# Altium project PCB_Project.PrjPcb
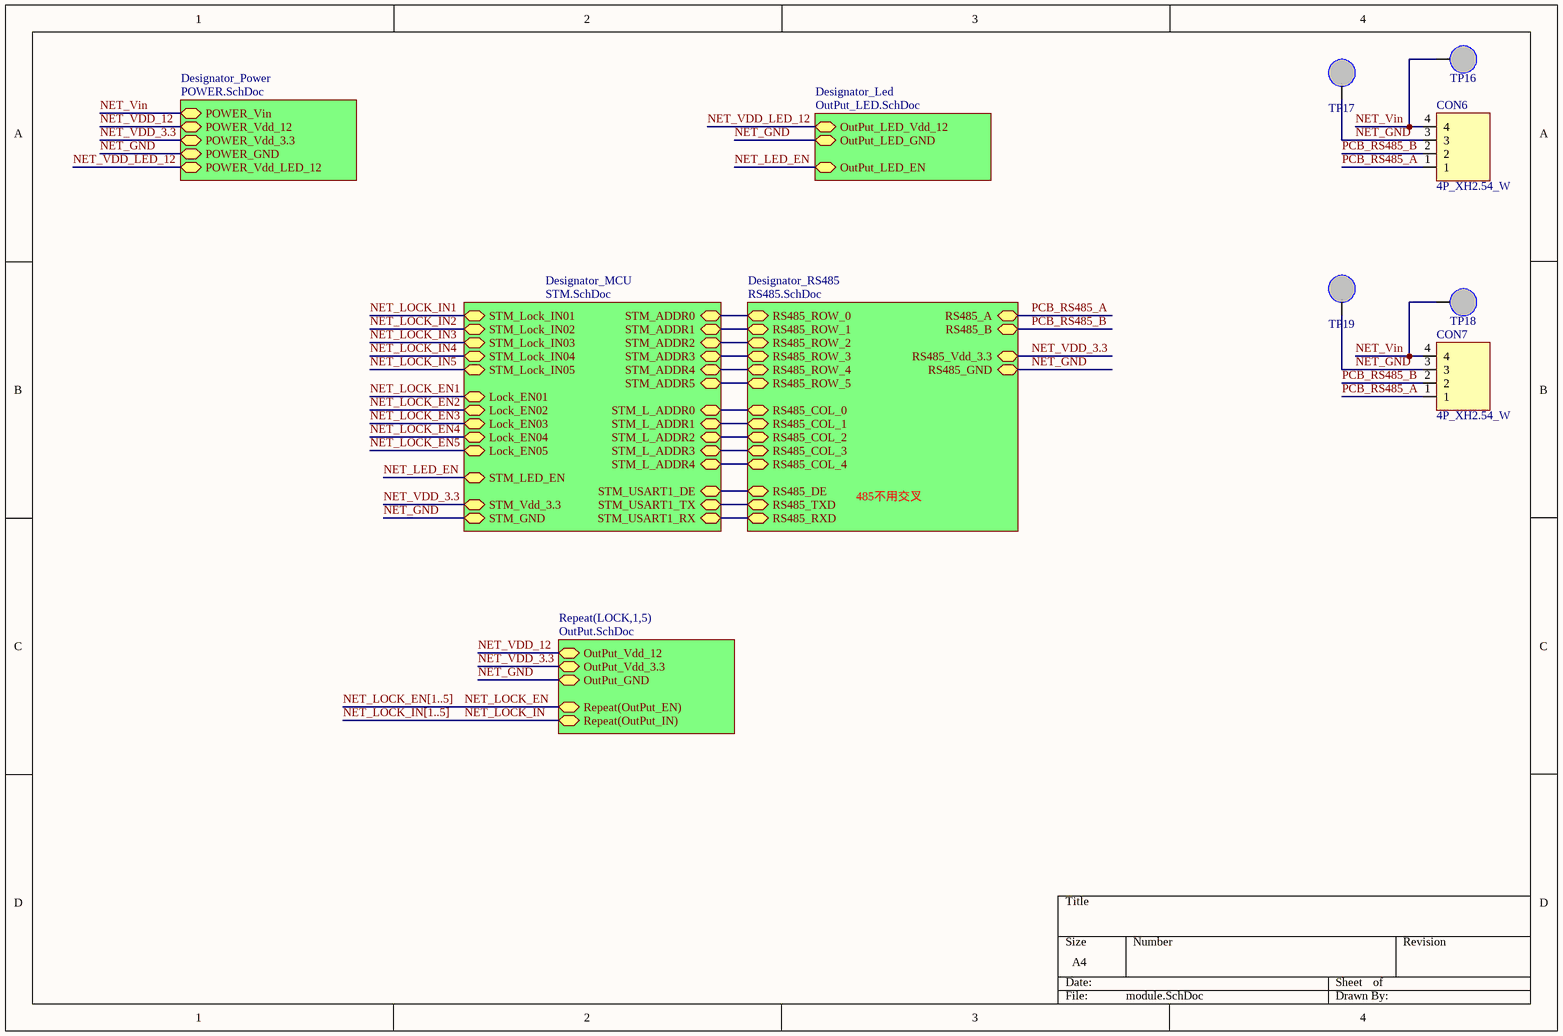
[diagram p0: module.SchDoc]
6 sheets, 158 parts. Net scope: strictly hierarchical (ports join the sheet entries above them; power ports are local).
Board file: Lock_5chanel.PcbDoc
Sheets:
  module.SchDoc
    Designator_MCU = STM.SchDoc
    Designator_Power = POWER.SchDoc
    LOCK1 = OutPut.SchDoc
    LOCK2 = OutPut.SchDoc
    LOCK3 = OutPut.SchDoc
    LOCK4 = OutPut.SchDoc
    LOCK5 = OutPut.SchDoc
    Designator_Led = OutPut_LED.SchDoc
    Designator_RS485 = RS485.SchDoc

## Sheet module.SchDoc
size A4

### Parts
CON6  4P_XH2.54_W  [XH2.54-WS-4P]
CON7  4P_XH2.54_W  [XH2.54-WS-4P]
TP16  TP  [TP]  (value not drawn)
TP17  TP  [TP]  (value not drawn)
TP18  TP  [TP]  (value not drawn)
TP19  TP  [TP]  (value not drawn)

### Sub-sheets
Designator_Led = OutPut_LED.SchDoc: OutPut_LED_Vdd_12, OutPut_LED_EN, OutPut_LED_GND
Designator_MCU = STM.SchDoc: STM_ADDR1, STM_ADDR5, STM_ADDR3, STM_ADDR2, STM_ADDR0, STM_ADDR4, STM_L_ADDR3, STM_L_ADDR1, STM_L_ADDR0, STM_L_ADDR2, STM_L_ADDR4, STM_USART1_RX, STM_USART1_TX, STM_USART1_DE, STM_Lock_IN05, STM_Lock_IN04, STM_Lock_IN01, STM_Lock_IN03, STM_Lock_IN02, Lock_EN05, Lock_EN04, Lock_EN03, Lock_EN02, Lock_EN01, STM_GND, STM_LED_EN, STM_Vdd_3.3
Designator_Power = POWER.SchDoc: POWER_GND, POWER_Vdd_12, POWER_Vdd_3.3, POWER_Vin, POWER_Vdd_LED_12
Designator_RS485 = RS485.SchDoc: RS485_ROW_4, RS485_ROW_2, RS485_ROW_3, RS485_ROW_0, RS485_ROW_1, RS485_COL_0, RS485_DE, RS485_RXD, RS485_GND, RS485_Vdd_3.3, RS485_TXD, RS485_COL_4, RS485_COL_3, RS485_COL_2, RS485_COL_1, RS485_ROW_5, RS485_A, RS485_B  | : 485不用交叉
Repeat(LOCK,1,5) = OutPut.SchDoc: OutPut_Vdd_3.3, Repeat(OutPut_EN), OutPut_Vdd_12, Repeat(OutPut_IN), OutPut_GND

### Nets
NET_GND: CON6.3 CON7.3 TP17.1 TP19.1 ; sheet Designator_MCU/STM_GND, sheet Designator_Power/POWER_GND, sheet Repeat(LOCK,1,5)/OutPut_GND, sheet Designator_Led/OutPut_LED_GND, sheet Designator_RS485/RS485_GND
NET_VDD_3.3: sheet Designator_MCU/STM_Vdd_3.3, sheet Designator_Power/POWER_Vdd_3.3, sheet Repeat(LOCK,1,5)/OutPut_Vdd_3.3, sheet Designator_RS485/RS485_Vdd_3.3
NET_VDD_12: sheet Designator_Power/POWER_Vdd_12, sheet Repeat(LOCK,1,5)/OutPut_Vdd_12
NET_VDD_LED_12: sheet Designator_Power/POWER_Vdd_LED_12, sheet Designator_Led/OutPut_LED_Vdd_12
ADDR0: sheet Designator_MCU/STM_ADDR0, sheet Designator_RS485/RS485_ROW_0
ADDR1: sheet Designator_MCU/STM_ADDR1, sheet Designator_RS485/RS485_ROW_1
ADDR2: sheet Designator_MCU/STM_ADDR2, sheet Designator_RS485/RS485_ROW_2
ADDR3: sheet Designator_MCU/STM_ADDR3, sheet Designator_RS485/RS485_ROW_3
ADDR4: sheet Designator_MCU/STM_ADDR4, sheet Designator_RS485/RS485_ROW_4
ADDR5: sheet Designator_MCU/STM_ADDR5, sheet Designator_RS485/RS485_ROW_5
COL_0: sheet Designator_MCU/STM_L_ADDR0, sheet Designator_RS485/RS485_COL_0
COL_1: sheet Designator_MCU/STM_L_ADDR1, sheet Designator_RS485/RS485_COL_1
COL_2: sheet Designator_MCU/STM_L_ADDR2, sheet Designator_RS485/RS485_COL_2
COL_3: sheet Designator_MCU/STM_L_ADDR3, sheet Designator_RS485/RS485_COL_3
COL_4: sheet Designator_MCU/STM_L_ADDR4, sheet Designator_RS485/RS485_COL_4
DE: sheet Designator_MCU/STM_USART1_DE, sheet Designator_RS485/RS485_DE
NET_LED_EN: sheet Designator_MCU/STM_LED_EN, sheet Designator_Led/OutPut_LED_EN  [project net EN]
NET_LOCK_EN: sheet Repeat(LOCK,1,5)/Repeat(OutPut_EN)
NET_LOCK_IN: sheet Repeat(LOCK,1,5)/Repeat(OutPut_IN)
NET_Vin: CON6.4 CON7.4 TP16.1 TP18.1 ; sheet Designator_Power/POWER_Vin
PCB_RS485_A: CON6.1 CON7.1 ; sheet Designator_RS485/RS485_A
PCB_RS485_B: CON6.2 CON7.2 ; sheet Designator_RS485/RS485_B
RXD: sheet Designator_MCU/STM_USART1_RX, sheet Designator_RS485/RS485_RXD
TXD: sheet Designator_MCU/STM_USART1_TX, sheet Designator_RS485/RS485_TXD

Not connected (* = marked no-connect by the designer): CON6 A B; CON7 A B

### Buses and harness runs
bus NET_LOCK_EN[1..5]
bus NET_LOCK_IN[1..5]

## Sheet STM.SchDoc
size A4
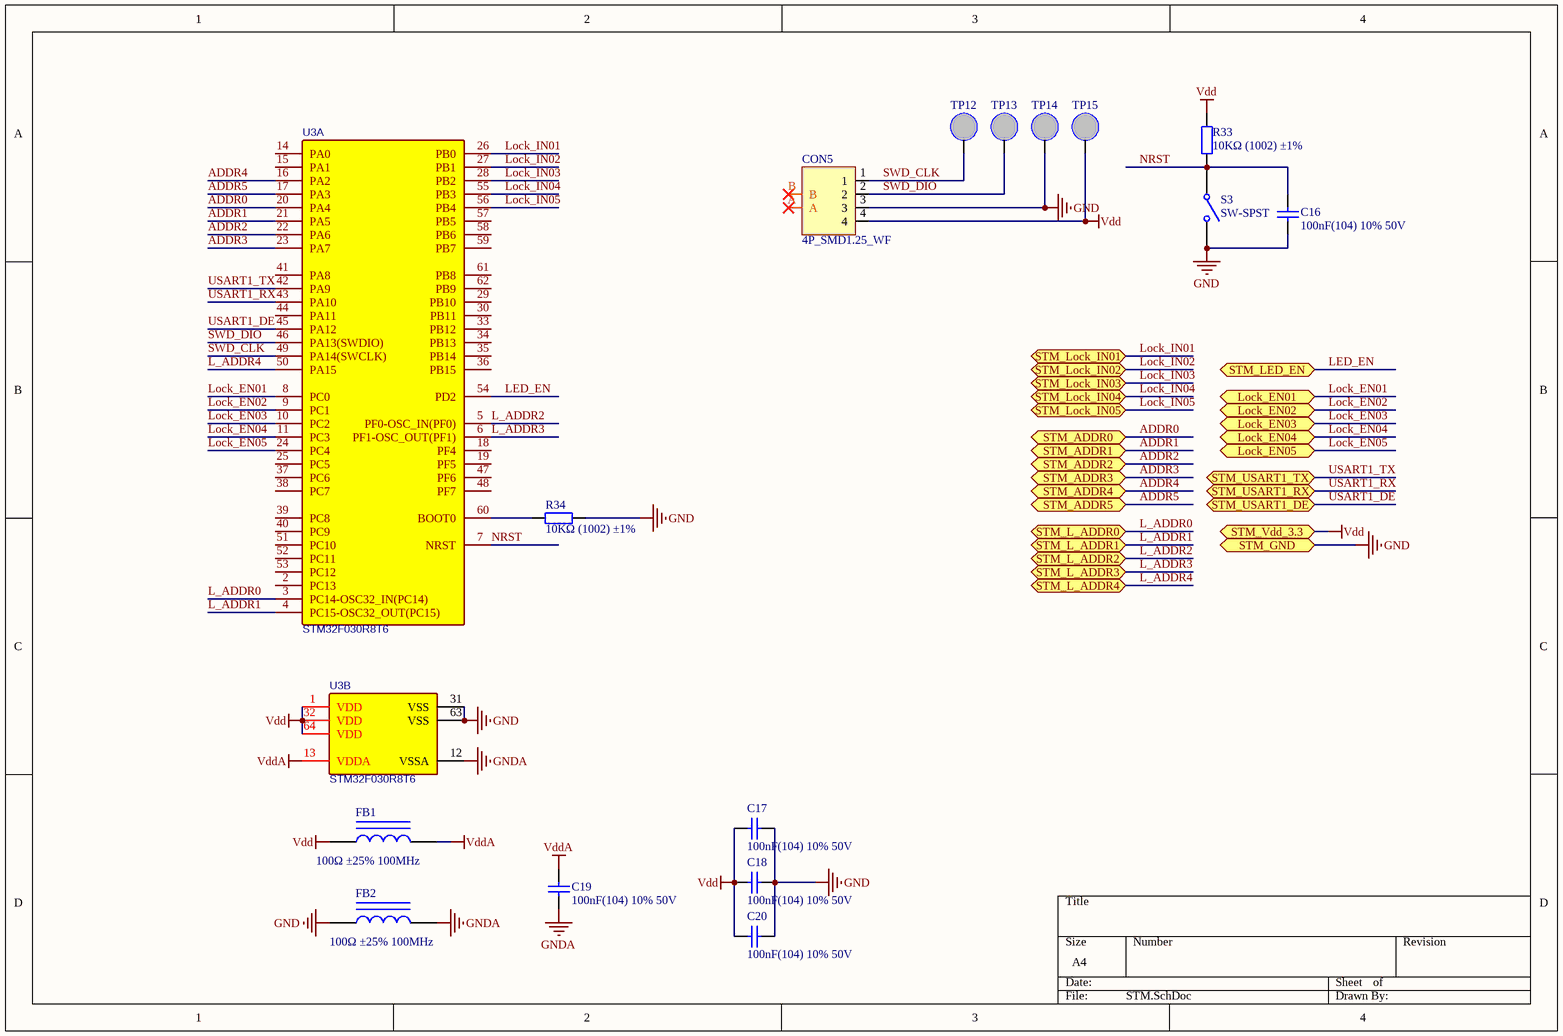
[diagram p1: STM.SchDoc]

### Parts
C16  100nF(104) 10% 50V  [0805_C]
C17  100nF(104) 10% 50V  [0805_C]
C18  100nF(104) 10% 50V  [0805_C]
C19  100nF(104) 10% 50V  [0805_C]
C20  100nF(104) 10% 50V  [0805_C]
CON5  4P_SMD1.25_WF  [MX 1.25-LS-4P]
FB1  100Ω ±25% 100MHz  [0805_L]
FB2  100Ω ±25% 100MHz  [0805_L]
R33  10KΩ (1002) ±1%  [0805_R]
R34  10KΩ (1002) ±1%  [0805_R]
S3  SW-SPST  [key]
TP12  TP  [TP]  (value not drawn)
TP13  TP  [TP]  (value not drawn)
TP14  TP  [TP]  (value not drawn)
TP15  TP  [TP]  (value not drawn)
U3  STM32F030R8T6  [LQFP-64_10X10X05P]  (parts A,B of 2)

### Ports
Lock_EN01, Lock_EN02, Lock_EN03, Lock_EN04, Lock_EN05, STM_ADDR0, STM_ADDR1, STM_ADDR2, STM_ADDR3, STM_ADDR4, STM_ADDR5, STM_GND, STM_L_ADDR0, STM_L_ADDR1, STM_L_ADDR2, STM_L_ADDR3, STM_L_ADDR4, STM_LED_EN, STM_Lock_IN01, STM_Lock_IN02, STM_Lock_IN03, STM_Lock_IN04, STM_Lock_IN05, STM_USART1_DE, STM_USART1_RX, STM_USART1_TX, STM_Vdd_3.3

### Nets
GND: C16.1 C17.1 C18.1 C20.1 CON5.3 FB2.1 R34.2 S3.2(NO) TP14.1 U3.31(VSS) U3.63(VSS) ; port STM_GND  [project net NET_GND]
GNDA: C19.1 FB2.2 U3.12(VSSA)
Vdd: C17.2 C18.2 C20.2 CON5.4 FB1.1 R33.2 TP15.1 U3.1(VDD) U3.32(VDD) U3.64(VDD) ; port STM_Vdd_3.3  [project net NET_VDD_3.3]
VddA: C19.2 FB1.2 U3.13(VDDA)
ADDR0: U3.20(PA4) ; port STM_ADDR0
ADDR1: U3.21(PA5) ; port STM_ADDR1
ADDR2: U3.22(PA6) ; port STM_ADDR2
ADDR3: U3.23(PA7) ; port STM_ADDR3
ADDR4: U3.16(PA2) ; port STM_ADDR4
ADDR5: U3.17(PA3) ; port STM_ADDR5
L_ADDR0: U3.3(PC14-OSC32_IN(PC14)) ; port STM_L_ADDR0  [project net COL_0]
L_ADDR1: U3.4(PC15-OSC32_OUT(PC15)) ; port STM_L_ADDR1  [project net COL_1]
L_ADDR2: U3.5(PF0-OSC_IN(PF0)) ; port STM_L_ADDR2  [project net COL_2]
L_ADDR3: U3.6(PF1-OSC_OUT(PF1)) ; port STM_L_ADDR3  [project net COL_3]
L_ADDR4: U3.50(PA15) ; port STM_L_ADDR4  [project net COL_4]
LED_EN: U3.54(PD2) ; port STM_LED_EN  [project net EN]
Lock_EN01: U3.8(PC0) ; port Lock_EN01  [project net EN]
Lock_EN02: U3.9(PC1) ; port Lock_EN02  [project net EN]
Lock_EN03: U3.10(PC2) ; port Lock_EN03  [project net EN]
Lock_EN04: U3.11(PC3) ; port Lock_EN04  [project net EN]
Lock_EN05: U3.24(PC4) ; port Lock_EN05  [project net EN]
Lock_IN01: U3.26(PB0) ; port STM_Lock_IN01  [project net IN]
Lock_IN02: U3.27(PB1) ; port STM_Lock_IN02  [project net IN]
Lock_IN03: U3.28(PB2) ; port STM_Lock_IN03  [project net IN]
Lock_IN04: U3.55(PB3) ; port STM_Lock_IN04  [project net IN]
Lock_IN05: U3.56(PB4) ; port STM_Lock_IN05  [project net IN]
NRST: C16.2 R33.1 S3.1(COMMON) U3.7(NRST)
SWD_CLK: CON5.1 TP12.1 U3.49(PA14(SWCLK))
SWD_DIO: CON5.2 TP13.1 U3.46(PA13(SWDIO))
USART1_DE: U3.45(PA12) ; port STM_USART1_DE  [project net DE]
USART1_RX: U3.43(PA10) ; port STM_USART1_RX  [project net RXD]
USART1_TX: U3.42(PA9) ; port STM_USART1_TX  [project net TXD]
NetR34_1: R34.1 U3.60(BOOT0)

Not connected (* = marked no-connect by the designer): CON5 A* B*; U3 2(PC13) 14(PA0) 15(PA1) 18(PF4) 19(PF5) 25(PC5) 29(PB10) 30(PB11) 33(PB12) 34(PB13) 35(PB14) 36(PB15) 37(PC6) 38(PC7) 39(PC8) 40(PC9) 41(PA8) 44(PA11) 47(PF6) 48(PF7) 51(PC10) 52(PC11) 53(PC12) 57(PB5) 58(PB6) 59(PB7) 61(PB8) 62(PB9)

### Library data of the parts
C16-C20 = 0805 100nF(104) 10% 50V: 贴片电容; ComponentLink1Description: 供应商链接; ComponentLink1URL: http://www.szlcsc.com/product/details_50686.html; Package: 0805; Supplier: LC; SuppliersPartNumber: C49678
CON5 = 4P_XH2.54_W
FB1 FB2 = 0805 100Ω 25% 100MHz: 贴片磁珠; ComponentLink1Description: 供应商链接; ComponentLink1URL: http://www.szlcsc.com/product/details_1367.html; Package: 0805; Supplier: LC; SuppliersPartNumber: C1015
R33 R34 = 0805 10KΩ (1002) 1%: 贴片电阻; ComponentLink1Description: 供应商链接; ComponentLink1URL: http://www.szlcsc.com/product/details_18102.html; Package: 0805; Supplier: LC; SuppliersPartNumber: C17414
S3 = SW-SPST: Single-Pole, Single-Throw Switch; Published: 24-Mar-1999; LatestRevisionDate: 17-Jul-2002; LatestRevisionNote: Re-released for DXP Platform.; PackageReference: SPST-2; Publisher: Altium Limited; PackageDescription: Switch; 2 Leads
U3 = STM32F030R8T6: BOM_Manufacturer: ST; subpart_no: 1; tags: STM32; BOM_Supplier Part: C39105; BOM_Supplier: LCSC; BOM_Manufacturer Part: STM32F030R8T6; image: http://image.lceda.cn/szlcsc/C39105.jpg; spicePre: U

## Sheet POWER.SchDoc
size A4
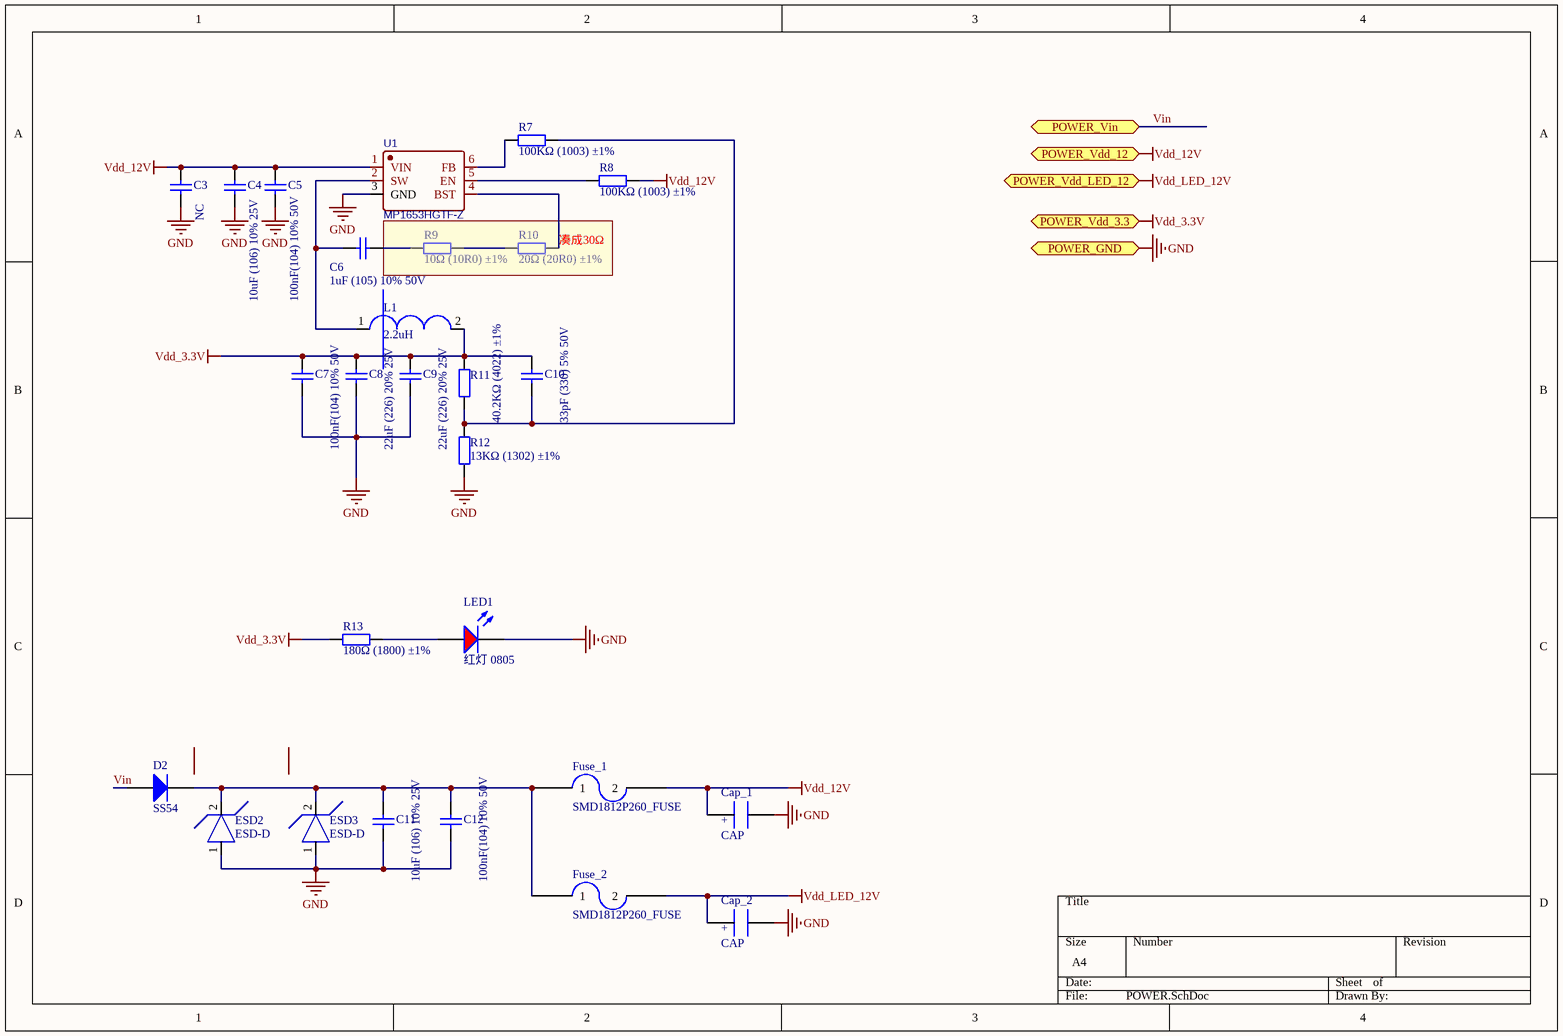
[diagram p2: POWER.SchDoc]

### Parts
C3  NC  [0805_C]
C4  10uF (106) 10% 25V  [0805_C]
C5  100nF(104) 10% 50V  [0805_C]
C6  1uF (105) 10% 50V  [0805_C]
C7  100nF(104) 10% 50V  [0805_C]
C8  22uF (226) 20% 25V  [0805_C]
C9  22uF (226) 20% 25V  [0805_C]
C10  33pF (330) 5% 50V  [0805_C]
C11  10uF (106) 10% 25V  [0805_C]
C12  100nF(104) 10% 50V  [0805_C]
Cap_1  CAP  [8X12_CAP]
Cap_2  CAP  [8X12_CAP]
D2  SS54  [SMA(DO-214AC)_S1]
ESD2  ESD-D  [SOD-523]
ESD3  ESD-D  [SOD-523]
Fuse_1  SMD1812P260_FUSE  [SMD1812P260]
Fuse_2  SMD1812P260_FUSE  [SMD1812P260]
L1  2.2uH  [L_4030]
LED1  红灯 0805  [0805_LED_S1]
R7  100KΩ (1003) ±1%  [0805_R]
R8  100KΩ (1003) ±1%  [0805_R]
R9  10Ω (10R0) ±1%  [0805_R]
R10  20Ω (20R0) ±1%  [0805_R]
R11  40.2KΩ (4022) ±1%  [0805_R]
R12  13KΩ (1302) ±1%  [0805_R]
R13  180Ω (1800) ±1%  [0805_R]
U1  MP1653HGTF-Z  [SOT563-6]

### Blocks framed on the sheet
凑成30Ω: R9 R10

### Ports
POWER_GND, POWER_Vdd_3.3, POWER_Vdd_12, POWER_Vdd_LED_12, POWER_Vin

### Nets
GND: C3.1 C4.1 C5.1 C7.1 C8.1 C9.1 C11.1 C12.1 Cap_1.2 Cap_2.2 ESD2.1 ESD3.1 LED1.K R12.1 U1.3(GND) ; port POWER_GND  [project net NET_GND]
Vdd_3.3V: C7.2 C8.2 C9.2 C10.2 L1.2 R11.1 R13.1 ; port POWER_Vdd_3.3  [project net NET_VDD_3.3]
Vdd_12V: C3.2 C4.2 C5.2 Cap_1.1 Fuse_1.2 R8.2 U1.1(VIN) ; port POWER_Vdd_12  [project net NET_VDD_12]
Vdd_LED_12V: Cap_2.1 Fuse_2.2 ; port POWER_Vdd_LED_12  [project net NET_VDD_LED_12]
Vin: D2.1(A) ; port POWER_Vin  [project net NET_Vin]
NetC6_1: C6.1 R9.2
NetC6_2: C6.2 L1.1 U1.2(SW)
NetC10_1: C10.1 R7.2 R11.2 R12.2
NetC11_2: C11.2 C12.2 D2.2(K) ESD2.2 ESD3.2 Fuse_1.1 Fuse_2.1
NetLED1_A: LED1.A R13.2
NetR7_1: R7.1 U1.6(FB)
NetR8_1: R8.1 U1.5(EN)
NetR9_1: R9.1 R10.2
NetR10_1: R10.1 U1.4(BST)

### Notes on the sheet
- (in symbol CAP) +

### Library data of the parts
C3 C4 C11 = 0805 10uF (106) 10% 25V: 贴片电容; ComponentLink1Description: 供应商链接; ComponentLink1URL: http://www.szlcsc.com/product/details_16532.html; Package: 0805; Supplier: LC; SuppliersPartNumber: C15850
C5 C7 C12 = 0805 100nF(104) 10% 50V: 贴片电容; ComponentLink1Description: 供应商链接; ComponentLink1URL: http://www.szlcsc.com/product/details_50686.html; Package: 0805; Supplier: LC; SuppliersPartNumber: C49678
C6 = 0805 1uF (105) 10% 50V: 贴片电容; ComponentLink1Description: 供应商链接; ComponentLink1URL: http://www.szlcsc.com/product/details_29074.html; Package: 0805; Supplier: LC; SuppliersPartNumber: C28323
C8 C9 = 0805 22uF (226) 20% 25V: 贴片电容; ComponentLink1Description: 供应商链接; ComponentLink1URL: http://www.szlcsc.com/product/details_46786.html; Package: 0805; Supplier: LC; SuppliersPartNumber: C45783
C10 = 0805 33pF (330) 5% 50V: 贴片电容; ComponentLink1Description: 供应商链接; ComponentLink1URL: http://www.szlcsc.com/product/details_2166.html; Package: 0805; Supplier: LC; SuppliersPartNumber: C1814
D2 = SMA(DO-214AC) SS54: 二极管; ComponentLink1Description: 供应商链接; ComponentLink1URL: http://www.szlcsc.com/product/details_23178.html; Package: SMA(DO-214AC); Supplier: LC; SuppliersPartNumber: C22452
L1 = 33uH
LED1 = 0805 红灯: 发光二极管; ComponentLink1Description: 供应商链接; ComponentLink1URL: http://www.szlcsc.com/product/details_2668.html; Package: 0805; Supplier: LC; SuppliersPartNumber: C2295
R7 R8 = 0805 100KΩ (1003) 1%: 贴片电阻; ComponentLink1Description: 供应商链接; ComponentLink1URL: http://www.szlcsc.com/product/details_18095.html; Package: 0805; Supplier: LC; SuppliersPartNumber: C17407
R9 = 0805 10Ω (10R0) 1%: 贴片电阻; ComponentLink1Description: 供应商链接; ComponentLink1URL: http://www.szlcsc.com/product/details_18103.html; Package: 0805; Supplier: LC; SuppliersPartNumber: C17415
R10 = 0805 20Ω (20R0) 1%: 贴片电阻; ComponentLink1Description: 供应商链接; ComponentLink1URL: http://www.szlcsc.com/product/details_18232.html; Package: 0805; Supplier: LC; SuppliersPartNumber: C17544
R11 = 0805 40.2KΩ (4022) 1%: 贴片电阻; ComponentLink1Description: 供应商链接; ComponentLink1URL: http://www.szlcsc.com/product/details_18366.html; Package: 0805; Supplier: LC; SuppliersPartNumber: C17678
R12 = 0805 13KΩ (1302) 1%: 贴片电阻; ComponentLink1Description: 供应商链接; ComponentLink1URL: http://www.szlcsc.com/product/details_18143.html; Package: 0805; Supplier: LC; SuppliersPartNumber: C17455
R13 = 0805 180Ω (1800) 1%: 贴片电阻; ComponentLink1Description: 供应商链接; ComponentLink1URL: http://www.szlcsc.com/product/details_26013.html; Package: 0805; Supplier: LC; SuppliersPartNumber: C25270
U1 = MP1653HGTF-Z: BOM_Manufacturer: MPS; BOM_Supplier: LCSC; BOM_Manufacturer Part: MP1653HGTF-Z; BOM_Supplier Part: C132613; spicePre: U

## Sheet OutPut.SchDoc
size A4
Used 5 times, as channels LOCK1, LOCK2, LOCK3, LOCK4, LOCK5. Parts and nets are listed once, with the designators drawn on the sheet.
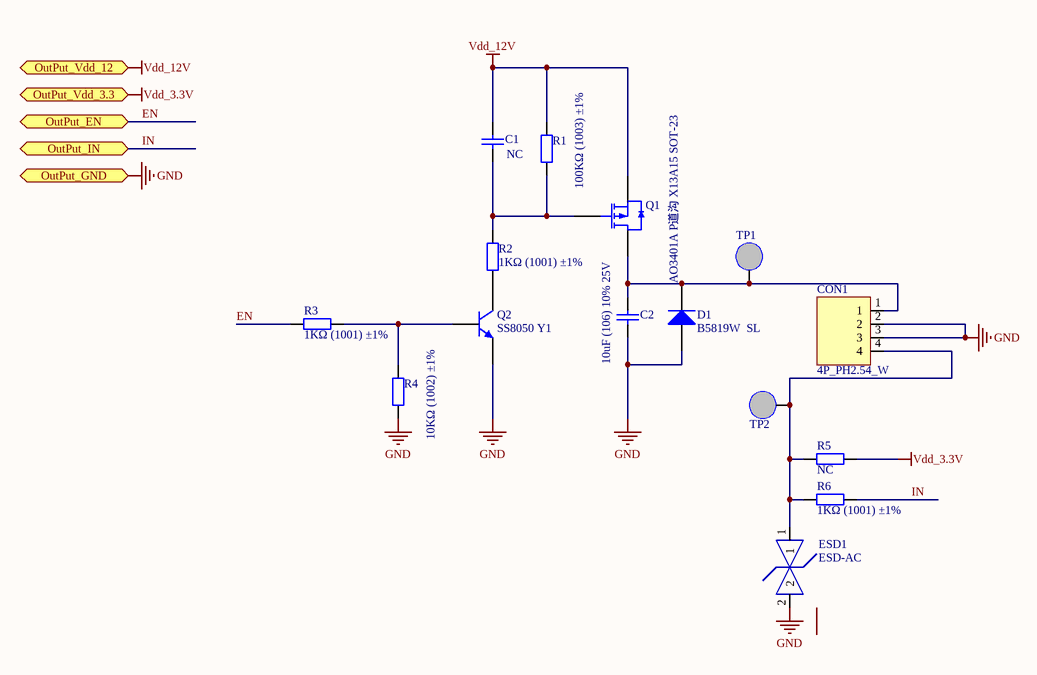
[diagram p3: OutPut.SchDoc]

### Parts
C1  NC  [0805_C]
C2  10uF (106) 10% 25V  [0805_C]
CON1  4P_PH2.54_W  [PH2.0-WS-4P]
D1  B5819W  SL  [SOD-123]
ESD1  ESD-AC  [SOD-523]
Q1  AO3401A P道沟 X13A15 SOT-23  [SOT-23-3L]
Q2  SS8050 Y1  [SOT-23(SOT-23-3)]
R1  100KΩ (1003) ±1%  [0805_R]
R2  1KΩ (1001) ±1%  [0805_R]
R3  1KΩ (1001) ±1%  [0805_R]
R4  10KΩ (1002) ±1%  [0805_R]
R5  NC  [0805_R]
R6  1KΩ (1001) ±1%  [0805_R]
TP1  TP  [TP]  (value not drawn)
TP2  TP  [TP]  (value not drawn)

### Ports
OutPut_EN, OutPut_GND, OutPut_IN, OutPut_Vdd_3.3, OutPut_Vdd_12

### Nets
GND: C2.1 CON1.2 CON1.3 D1.1(A) ESD1.2 Q2.2(E) R4.1 ; port OutPut_GND
Vdd_3.3V: R5.2 ; port OutPut_Vdd_3.3
Vdd_12V: C1.2 Q1.2(S) R1.2 ; port OutPut_Vdd_12
EN: R3.1 ; port OutPut_EN
IN: R6.2 ; port OutPut_IN
NetC1_1: C1.1 Q1.1(G) R1.1 R2.1
NetC2_2: C2.2 CON1.1 D1.2(K) Q1.3(D) TP1.1
NetCON1_4: CON1.4 ESD1.1 R5.1 R6.1 TP2.1
NetQ2_1: Q2.1(B) R3.2 R4.2
NetQ2_3: Q2.3(C) R2.2

Not connected (* = marked no-connect by the designer): CON1 A B

### Channels
LOCK1: designators end in _LOCK1; ports OutPut_EN=EN OutPut_GND=NET_GND OutPut_IN=IN OutPut_Vdd_3.3=NET_VDD_3.3 OutPut_Vdd_12=NET_VDD_12
LOCK2: designators end in _LOCK2; ports OutPut_EN=EN OutPut_GND=NET_GND OutPut_IN=IN OutPut_Vdd_3.3=NET_VDD_3.3 OutPut_Vdd_12=NET_VDD_12
LOCK3: designators end in _LOCK3; ports OutPut_EN=EN OutPut_GND=NET_GND OutPut_IN=IN OutPut_Vdd_3.3=NET_VDD_3.3 OutPut_Vdd_12=NET_VDD_12
LOCK4: designators end in _LOCK4; ports OutPut_EN=EN OutPut_GND=NET_GND OutPut_IN=IN OutPut_Vdd_3.3=NET_VDD_3.3 OutPut_Vdd_12=NET_VDD_12
LOCK5: designators end in _LOCK5; ports OutPut_EN=EN OutPut_GND=NET_GND OutPut_IN=IN OutPut_Vdd_3.3=NET_VDD_3.3 OutPut_Vdd_12=NET_VDD_12

### Library data of the parts
C1 = 0805 22uF (226) 20% 25V: 贴片电容; ComponentLink1Description: 供应商链接; ComponentLink1URL: http://www.szlcsc.com/product/details_46786.html; Package: 0805; Supplier: LC; SuppliersPartNumber: C45783
C2 = 0805 10uF (106) 10% 25V: 贴片电容; ComponentLink1Description: 供应商链接; ComponentLink1URL: http://www.szlcsc.com/product/details_16532.html; Package: 0805; Supplier: LC; SuppliersPartNumber: C15850
CON1 = 4P_XH2.54_W
D1 = SOD-123 B5819W  SL: 肖特基二极管; ComponentLink1Description: 供应商链接; ComponentLink1URL: http://www.szlcsc.com/product/details_9093.html; Package: SOD-123; Supplier: LC; SuppliersPartNumber: C8598
Q1 = AO3401A P道沟 X13A15 SOT-23: MOS(场效应管); ComponentLink1Description: 供应商链接; ComponentLink1URL: http://www.szlcsc.com/product/details_15801.html; Package: SOT-23; Supplier: LC; SuppliersPartNumber: C15127
Q2 = SOT-23 SS8050 Y1: 三极管; ComponentLink1Description: 供应商链接; ComponentLink1URL: http://www.szlcsc.com/product/details_2507.html; Package: SOT-23; Supplier: LC; SuppliersPartNumber: C2150
R1 = 0805 100KΩ (1003) 1%: 贴片电阻; ComponentLink1Description: 供应商链接; ComponentLink1URL: http://www.szlcsc.com/product/details_18095.html; Package: 0805; Supplier: LC; SuppliersPartNumber: C17407
R2 R3 R5 R6 = 0805 1KΩ (1001) 1%: 贴片电阻; ComponentLink1Description: 供应商链接; ComponentLink1URL: http://www.szlcsc.com/product/details_18201.html; Package: 0805; Supplier: LC; SuppliersPartNumber: C17513
R4 = 0805 10KΩ (1002) 1%: 贴片电阻; ComponentLink1Description: 供应商链接; ComponentLink1URL: http://www.szlcsc.com/product/details_18102.html; Package: 0805; Supplier: LC; SuppliersPartNumber: C17414

## Sheet OutPut_LED.SchDoc
size A4
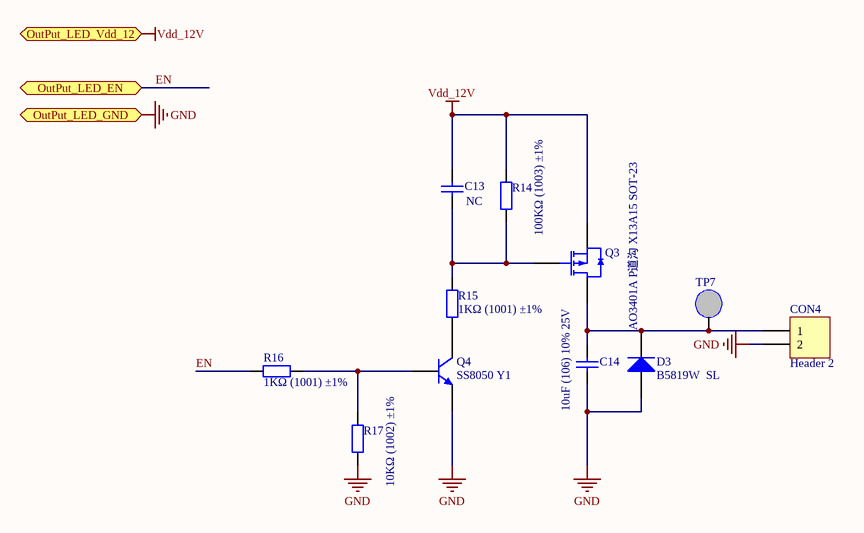
[diagram p4: OutPut_LED.SchDoc]

### Parts
C13  NC  [0805_C]
C14  10uF (106) 10% 25V  [0805_C]
CON4  Header 2  [PH2.0-WS-2P]
D3  B5819W  SL  [SOD-123]
Q3  AO3401A P道沟 X13A15 SOT-23  [SOT-23-3L]
Q4  SS8050 Y1  [SOT-23(SOT-23-3)]
R14  100KΩ (1003) ±1%  [0805_R]
R15  1KΩ (1001) ±1%  [0805_R]
R16  1KΩ (1001) ±1%  [0805_R]
R17  10KΩ (1002) ±1%  [0805_R]
TP7  TP  [TP]  (value not drawn)

### Ports
OutPut_LED_EN, OutPut_LED_GND, OutPut_LED_Vdd_12

### Nets
GND: C14.1 CON4.2 D3.1(A) Q4.2(E) R17.1 ; port OutPut_LED_GND  [project net NET_GND]
Vdd_12V: C13.2 Q3.2(S) R14.2 ; port OutPut_LED_Vdd_12  [project net NET_VDD_LED_12]
EN: R16.1 ; port OutPut_LED_EN
NetC13_1: C13.1 Q3.1(G) R14.1 R15.1
NetC14_2: C14.2 CON4.1 D3.2(K) Q3.3(D) TP7.1
NetQ4_1: Q4.1(B) R16.2 R17.2
NetQ4_3: Q4.3(C) R15.2

### Library data of the parts
C13 = 0805 22uF (226) 20% 25V: 贴片电容; ComponentLink1Description: 供应商链接; ComponentLink1URL: http://www.szlcsc.com/product/details_46786.html; Package: 0805; Supplier: LC; SuppliersPartNumber: C45783
C14 = 0805 10uF (106) 10% 25V: 贴片电容; ComponentLink1Description: 供应商链接; ComponentLink1URL: http://www.szlcsc.com/product/details_16532.html; Package: 0805; Supplier: LC; SuppliersPartNumber: C15850
CON4 = Header 2: Header, 2-Pin; LatestRevisionDate: 17-Jul-2002; LatestRevisionNote: Re-released for DXP Platform.; Publisher: Altium Limited
D3 = SOD-123 B5819W  SL: 肖特基二极管; ComponentLink1Description: 供应商链接; ComponentLink1URL: http://www.szlcsc.com/product/details_9093.html; Package: SOD-123; Supplier: LC; SuppliersPartNumber: C8598
Q3 = AO3401A P道沟 X13A15 SOT-23: MOS(场效应管); ComponentLink1Description: 供应商链接; ComponentLink1URL: http://www.szlcsc.com/product/details_15801.html; Package: SOT-23; Supplier: LC; SuppliersPartNumber: C15127
Q4 = SOT-23 SS8050 Y1: 三极管; ComponentLink1Description: 供应商链接; ComponentLink1URL: http://www.szlcsc.com/product/details_2507.html; Package: SOT-23; Supplier: LC; SuppliersPartNumber: C2150
R14 = 0805 100KΩ (1003) 1%: 贴片电阻; ComponentLink1Description: 供应商链接; ComponentLink1URL: http://www.szlcsc.com/product/details_18095.html; Package: 0805; Supplier: LC; SuppliersPartNumber: C17407
R15 R16 = 0805 1KΩ (1001) 1%: 贴片电阻; ComponentLink1Description: 供应商链接; ComponentLink1URL: http://www.szlcsc.com/product/details_18201.html; Package: 0805; Supplier: LC; SuppliersPartNumber: C17513
R17 = 0805 10KΩ (1002) 1%: 贴片电阻; ComponentLink1Description: 供应商链接; ComponentLink1URL: http://www.szlcsc.com/product/details_18102.html; Package: 0805; Supplier: LC; SuppliersPartNumber: C17414

## Sheet RS485.SchDoc
size A4
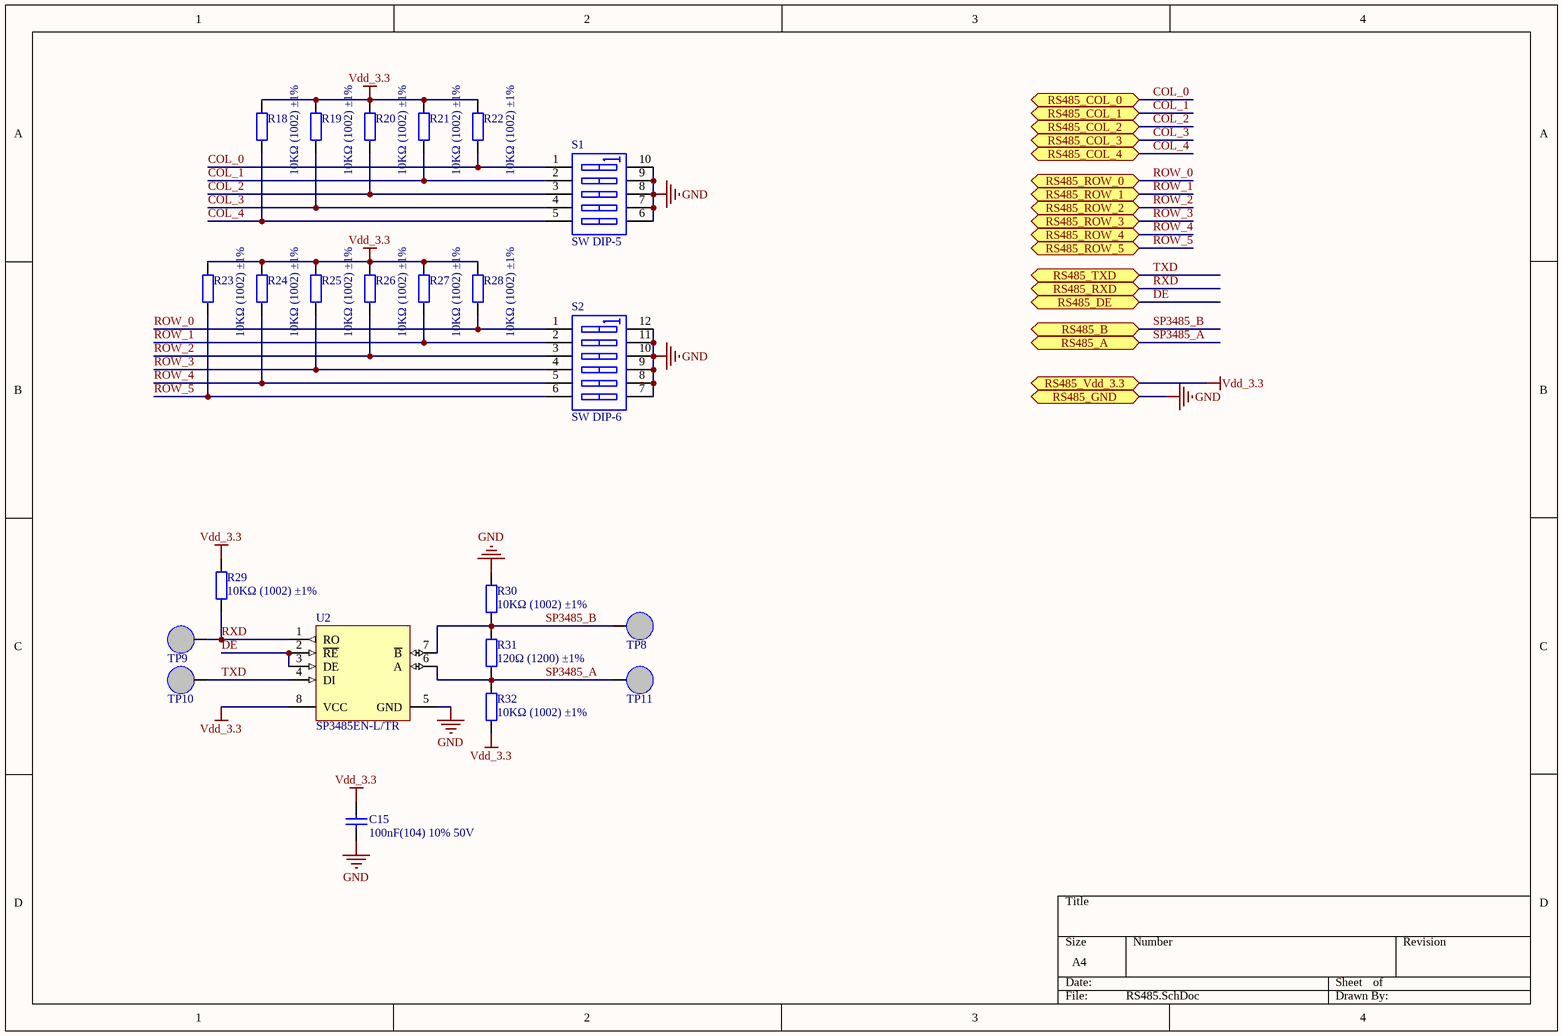
[diagram p5: RS485.SchDoc]

### Parts
C15  100nF(104) 10% 50V  [0805_C]
R18  10KΩ (1002) ±1%  [0805_R]
R19  10KΩ (1002) ±1%  [0805_R]
R20  10KΩ (1002) ±1%  [0805_R]
R21  10KΩ (1002) ±1%  [0805_R]
R22  10KΩ (1002) ±1%  [0805_R]
R23  10KΩ (1002) ±1%  [0805_R]
R24  10KΩ (1002) ±1%  [0805_R]
R25  10KΩ (1002) ±1%  [0805_R]
R26  10KΩ (1002) ±1%  [0805_R]
R27  10KΩ (1002) ±1%  [0805_R]
R28  10KΩ (1002) ±1%  [0805_R]
R29  10KΩ (1002) ±1%  [0805_R]
R30  10KΩ (1002) ±1%  [0805_R]
R31  120Ω (1200) ±1%  [0805_R]
R32  10KΩ (1002) ±1%  [0805_R]
S1  SW DIP-5  [N10A]
S2  SW DIP-6  [DIP-12/SW]
TP8  TP  [TP]  (value not drawn)
TP9  TP  [TP]  (value not drawn)
TP10  TP  [TP]  (value not drawn)
TP11  TP  [TP]  (value not drawn)
U2  SP3485EN-L/TR  [SOIC-8_150mil]

### Ports
RS485_A, RS485_B, RS485_COL_0, RS485_COL_1, RS485_COL_2, RS485_COL_3, RS485_COL_4, RS485_DE, RS485_GND, RS485_ROW_0, RS485_ROW_1, RS485_ROW_2, RS485_ROW_3, RS485_ROW_4, RS485_ROW_5, RS485_RXD, RS485_TXD, RS485_Vdd_3.3

### Nets
GND: C15.2 R30.2 S1.6(B5) S1.7(B4) S1.8(B3) S1.9(B2) S1.10(B1) S2.7(B6) S2.8(B5) S2.9(B4) S2.10(B3) S2.11(B2) S2.12(B1) U2.5(GND) ; port RS485_GND  [project net NET_GND]
Vdd_3.3: C15.1 R18.2 R19.2 R20.2 R21.2 R22.2 R23.2 R24.2 R25.2 R26.2 R27.2 R28.2 R29.2 R32.1 U2.8(VCC) ; port RS485_Vdd_3.3  [project net NET_VDD_3.3]
COL_0: R22.1 S1.1(A1) ; port RS485_COL_0
COL_1: R21.1 S1.2(A2) ; port RS485_COL_1
COL_2: R20.1 S1.3(A3) ; port RS485_COL_2
COL_3: R19.1 S1.4(A4) ; port RS485_COL_3
COL_4: R18.1 S1.5(A5) ; port RS485_COL_4
DE: U2.2(~{RE}) U2.3(DE) ; port RS485_DE
ROW_0: R28.1 S2.1(A1) ; port RS485_ROW_0  [project net ADDR0]
ROW_1: R27.1 S2.2(A2) ; port RS485_ROW_1  [project net ADDR1]
ROW_2: R26.1 S2.3(A3) ; port RS485_ROW_2  [project net ADDR2]
ROW_3: R25.1 S2.4(A4) ; port RS485_ROW_3  [project net ADDR3]
ROW_4: R24.1 S2.5(A5) ; port RS485_ROW_4  [project net ADDR4]
ROW_5: R23.1 S2.6(A6) ; port RS485_ROW_5  [project net ADDR5]
RXD: R29.1 TP9.1 U2.1(RO) ; port RS485_RXD
SP3485_A: R31.1 R32.2 TP11.1 U2.6(A) ; port RS485_A  [project net PCB_RS485_A]
SP3485_B: R30.1 R31.2 TP8.1 U2.7(~{B}) ; port RS485_B  [project net PCB_RS485_B]
TXD: TP10.1 U2.4(DI) ; port RS485_TXD

### Library data of the parts
C15 = 0805 100nF(104) 10% 50V: 贴片电容; ComponentLink1Description: 供应商链接; ComponentLink1URL: http://www.szlcsc.com/product/details_50686.html; Package: 0805; Supplier: LC; SuppliersPartNumber: C49678
R18-R30 R32 = 0805 10KΩ (1002) 1%: 贴片电阻; ComponentLink1Description: 供应商链接; ComponentLink1URL: http://www.szlcsc.com/product/details_18102.html; Package: 0805; Supplier: LC; SuppliersPartNumber: C17414
R31 = 0805 120Ω (1200) 1%: 贴片电阻; ComponentLink1Description: 供应商链接; ComponentLink1URL: http://www.szlcsc.com/product/details_18125.html; Package: 0805; Supplier: LC; SuppliersPartNumber: C17437
S1 = SW DIP-5: DIP Switch, 5 Position, SPST; Published: 24-Mar-1999; LatestRevisionDate: 17-Jul-2002; LatestRevisionNote: Re-released for DXP Platform.; PackageReference: N10A; Publisher: Altium Limited
S2 = SW DIP-6: DIP Switch, 6 Position, SPST; Published: 24-Mar-1999; LatestRevisionDate: 17-Jul-2002; LatestRevisionNote: Re-released for DXP Platform.; PackageReference: DIP-12/SW; Publisher: Altium Limited; PackageDescription: DIP Switch; 12 Leads
U2 = SP3485EN-L/TR_[C8963]: RS-485/RS-422; ComponentLink1Description: 供应商链接; ComponentLink1URL: http://www.szlcsc.com/product/details_9482.html; Package: SOIC-8; Supplier: LC; SuppliersPartNumber: C8963

## Nets that join several sheets
NET_GND: module (CON6.3 CON7.3 TP17.1 TP19.1), STM (11 pins), POWER (15 pins), LOCK1 (7 pins), LOCK2 (7 pins), LOCK3 (7 pins), LOCK4 (7 pins), LOCK5 (7 pins), OutPut_LED (5 pins), RS485 (14 pins)
NET_VDD_3.3: STM (10 pins), POWER (7 pins), LOCK1 (R5_LOCK1.2), LOCK2 (R5_LOCK2.2), LOCK3 (R5_LOCK3.2), LOCK4 (R5_LOCK4.2), LOCK5 (R5_LOCK5.2), RS485 (15 pins)
NET_VDD_12: POWER (7 pins), LOCK1 (C1_LOCK1.2 Q1_LOCK1.2 R1_LOCK1.2), LOCK2 (C1_LOCK2.2 Q1_LOCK2.2 R1_LOCK2.2), LOCK3 (C1_LOCK3.2 Q1_LOCK3.2 R1_LOCK3.2), LOCK4 (C1_LOCK4.2 Q1_LOCK4.2 R1_LOCK4.2), LOCK5 (C1_LOCK5.2 Q1_LOCK5.2 R1_LOCK5.2)
NET_VDD_LED_12: POWER (Cap_2.1 Fuse_2.2), OutPut_LED (C13.2 Q3.2 R14.2)
ADDR0: STM (U3.20), RS485 (R28.1 S2.1)
ADDR1: STM (U3.21), RS485 (R27.1 S2.2)
ADDR2: STM (U3.22), RS485 (R26.1 S2.3)
ADDR3: STM (U3.23), RS485 (R25.1 S2.4)
ADDR4: STM (U3.16), RS485 (R24.1 S2.5)
ADDR5: STM (U3.17), RS485 (R23.1 S2.6)
COL_0: STM (U3.3), RS485 (R22.1 S1.1)
COL_1: STM (U3.4), RS485 (R21.1 S1.2)
COL_2: STM (U3.5), RS485 (R20.1 S1.3)
COL_3: STM (U3.6), RS485 (R19.1 S1.4)
COL_4: STM (U3.50), RS485 (R18.1 S1.5)
DE: STM (U3.45), RS485 (U2.2 U2.3)
EN: STM (U3.8), LOCK1 (R3_LOCK1.1)
EN: STM (U3.9), LOCK2 (R3_LOCK2.1)
EN: STM (U3.10), LOCK3 (R3_LOCK3.1)
EN: STM (U3.11), LOCK4 (R3_LOCK4.1)
EN: STM (U3.24), LOCK5 (R3_LOCK5.1)
EN: STM (U3.54), OutPut_LED (R16.1)
IN: STM (U3.26), LOCK1 (R6_LOCK1.2)
IN: STM (U3.27), LOCK2 (R6_LOCK2.2)
IN: STM (U3.28), LOCK3 (R6_LOCK3.2)
IN: STM (U3.55), LOCK4 (R6_LOCK4.2)
IN: STM (U3.56), LOCK5 (R6_LOCK5.2)
NET_Vin: module (CON6.4 CON7.4 TP16.1 TP18.1), POWER (D2.1)
PCB_RS485_A: module (CON6.1 CON7.1), RS485 (R31.1 R32.2 TP11.1 U2.6)
PCB_RS485_B: module (CON6.2 CON7.2), RS485 (R30.1 R31.2 TP8.1 U2.7)
RXD: STM (U3.43), RS485 (R29.1 TP9.1 U2.1)
TXD: STM (U3.42), RS485 (TP10.1 U2.4)